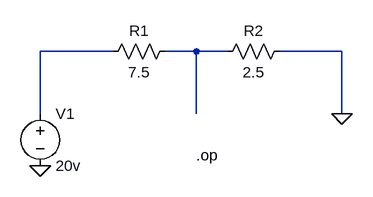
[diagram p0: schematic vd1.asc]
vd1.asc, the LTspice schematic file:
Version 4
SHEET 1 880 680
WIRE 288 176 176 176
WIRE 416 176 368 176
WIRE 464 176 416 176
WIRE 640 176 544 176
WIRE 176 272 176 176
WIRE 416 272 416 176
WIRE 640 272 640 176
FLAG 176 352 0
FLAG 640 272 0
SYMBOL voltage 176 256 R0
SYMATTR InstName V1
SYMATTR Value 20v
SYMBOL Res 560 160 R90
WINDOW 0 0 56 VBottom 2
WINDOW 3 32 56 VTop 2
SYMATTR InstName R2
SYMATTR Value 2.5
SYMBOL Res 384 160 R90
WINDOW 0 0 56 VBottom 2
WINDOW 3 32 56 VTop 2
SYMATTR InstName R1
SYMATTR Value 7.5
TEXT 416 336 Left 2 !.op

The netlist it stands for:
* vd1.asc
V1 N001 0 20v
R2 0 N002 2.5
R1 N002 N001 7.5
.op
.backanno
.end